# Altium project PCB_Project.PrjPcb
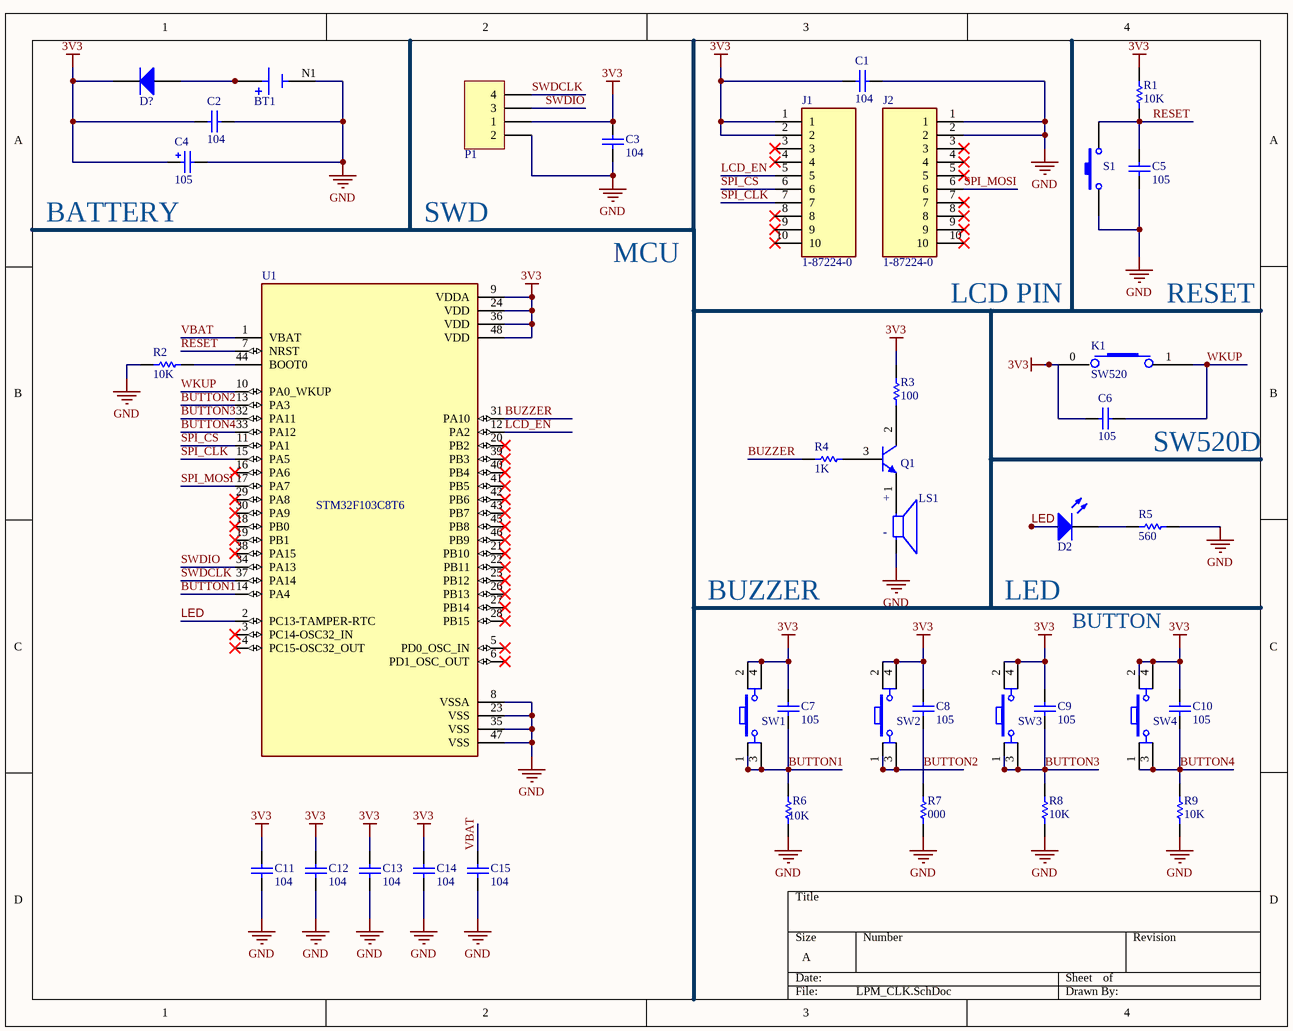
[diagram p0: LPM_CLK.SchDoc]
1 sheet, 39 parts. Net scope: global (net labels, ports and power ports of the same name join across sheets).
Board file: LPM_CLK.PcbDoc

## Sheet LPM_CLK.SchDoc
size A; SheetNumber: 1; SheetTotal: 1

### Parts
BT1  BAT-HLD-001  [BAT_BAT-HLD-001]  (value not drawn)
C1  value 104  [CAP-SM-0805]  (hidden comment: Cap Non-Pol SMD)
C2  value 104  [CAP-SM-0805]  (hidden comment: Cap Non-Pol SMD)
C3  value 104  [CAP-SM-0805]  (hidden comment: Cap Non-Pol SMD)
C4  value 105  [CP1/2]  (hidden comment: Cap Pol)
C5  value 105  [CAP-SM-0805]  (hidden comment: Cap Non-Pol SMD)
C6  value 105  [CAP-SM-0805]  (hidden comment: Cap Non-Pol SMD)
C7  value 105  [CAP-SM-0805]  (hidden comment: Cap Non-Pol SMD)
C8  value 105  [CAP-SM-0805]  (hidden comment: Cap Non-Pol SMD)
C9  value 105  [CAP-SM-0805]  (hidden comment: Cap Non-Pol SMD)
C10  value 105  [CAP-SM-0805]  (hidden comment: Cap Non-Pol SMD)
C11  value 104  [CAP-SM-0805]  (hidden comment: Cap Non-Pol SMD)
C12  value 104  [CAP-SM-0805]  (hidden comment: Cap Non-Pol SMD)
C13  value 104  [CAP-SM-0805]  (hidden comment: Cap Non-Pol SMD)
C14  value 104  [CAP-SM-0805]  (hidden comment: Cap Non-Pol SMD)
C15  value 104  [CAP-SM-0805]  (hidden comment: Cap Non-Pol SMD)
D2  LED SMD  [LED_0603_Blue]  (value not drawn)
D?  Diode  [D1A]  (value not drawn)
J1  1-87224-0  [TE_1-87224-0]
J2  1-87224-0  [TE_1-87224-0]
K1  SW520  [SW520D]
LS1  CMT-7525-80-SMT-TR  [XDCR_CMT-7525-80-SMT-TR]  (value not drawn)
P1  Header 4H  [JP4H]  (value not drawn)
Q1  C1815  [QTO-92]  (value not drawn)
R1  value 10K  [RES-SM-0603]  (hidden comment: RESISTOR SMD)
R2  value 10K  [RES-SM-0603]  (hidden comment: RESISTOR SMD)
R3  value 100  [RES-SM-0603]  (hidden comment: RESISTOR SMD)
R4  value 1K  [RES-SM-0603]  (hidden comment: RESISTOR SMD)
R5  value 560  [RES-SM-0603]  (hidden comment: RESISTOR SMD)
R6  value 10K  [RES-SM-0603]  (hidden comment: RESISTOR SMD)
R7  value 000  [RES-SM-0603]  (hidden comment: RESISTOR SMD)
R8  value 10K  [RES-SM-0603]  (hidden comment: RESISTOR SMD)
R9  value 10K  [RES-SM-0603]  (hidden comment: RESISTOR SMD)
S1  Tact SW - 2Pin  [SW-SMD]  (value not drawn)
SW1  SW  [Tact SW 4 pin]  (value not drawn)
SW2  SW  [Tact SW 4 pin]  (value not drawn)
SW3  SW  [Tact SW 4 pin]  (value not drawn)
SW4  SW  [Tact SW 4 pin]  (value not drawn)
U1  STM32F103C8T6  [QFP50P900X900X160-48N]

### Nets
3V3: C1.2 C2.1 C3.2 C4.1 C6.2 C7.2 C8.2 C9.2 C10.2 C11.2 C12.1 C13.2 C14.2 D?.2(K) J1.1 J1.2 K1.0(+) P1.1 R1.2 R3.2 SW1.2 SW1.4 SW2.2 SW2.4 SW3.2 SW3.4 SW4.2 SW4.4 U1.9(VDDA) U1.24(VDD) U1.36(VDD) U1.48(VDD)
GND: BT1.N1(NEG) C1.1 C2.2 C3.1 C4.2 C5.1 C11.1 C12.2 C13.1 C14.1 C15.1 J2.1 J2.2 LS1.N P1.2 R2.1 R5.2 R6.1 R7.1 R8.1 R9.1 S1.1 U1.8(VSSA) U1.23(VSS) U1.35(VSS) U1.47(VSS)
BUTTON1: C7.1 R6.2 SW1.1 SW1.3 U1.14(PA4)
BUTTON2: C8.1 R7.2 SW2.1 SW2.3 U1.13(PA3)
BUTTON3: C9.1 R8.2 SW3.1 SW3.3 U1.32(PA11)
BUTTON4: C10.1 R9.2 SW4.1 SW4.3 U1.33(PA12)
BUZZER: R4.1 U1.31(PA10)
LCD_EN: J1.5 U1.12(PA2)
LED: D2.1(A) U1.2(PC13-TAMPER-RTC)
RESET: C5.2 R1.1 S1.2 U1.7(NRST)
SPI_CLK: J1.7 U1.15(PA5)
SPI_CS: J1.6 U1.11(PA1)
SPI_MOSI: J2.6 U1.17(PA7)
SWDCLK: P1.4 U1.37(PA14)
SWDIO: P1.3 U1.34(PA13)
VBAT: C15.2 U1.1(VBAT)
WKUP: C6.1 K1.1(-) U1.10(PA0_WKUP)
NetBT1_P1: BT1.P1(POS) BT1.P2(POS) D?.1(A)
NetD2_2: D2.2(K) R5.1
NetLS1_P: LS1.P Q1.1(E)
NetQ1_2: Q1.2(C) R3.1
NetQ1_3: Q1.3(B) R4.2
NetR2_2: R2.2 U1.44(BOOT0)

Not connected (* = marked no-connect by the designer): J1 3* 4* 8* 9* 10*; J2 3* 4* 5* 7* 8* 9* 10*; U1 3(PC14-OSC32_IN)* 4(PC15-OSC32_OUT)* 5(PD0_OSC_IN)* 6(PD1_OSC_OUT)* 16(PA6)* 18(PB0)* 19(PB1)* 20(PB2)* 21(PB10)* 22(PB11)* 25(PB12)* 26(PB13)* 27(PB14)* 28(PB15)* 29(PA8)* 30(PA9)* 38(PA15)* 39(PB3)* 40(PB4)* 41(PB5)* 42(PB6)* 43(PB7)* 45(PB8)* 46(PB9)*

### Notes on the sheet
- (near C4) BATTERY
- SWD
- MCU
- (near J2) LCD PIN
- RESET
- SW520D
- BUZZER
- (near D2) LED
- BUTTON
- (in symbol CMT-7525-80-SMT-TR) +; -

### Library data of the parts
BT1 = BAT-HLD-001: Battery Retainer Coin, 20.0mm 1 Cell SMD (SMT) Tab; Value: *; MP: BAT-HLD-001; Package: None; Availability: Unavailable; Price: None
C1-C3 C5-C15 = Cap Non-Pol SMD: Capacitor
C4 = Cap Pol: Polarized Capacitor (Radial)
D2 = LED SMD: LED
D? = Diode: Default Diode
J1 J2 = 1-87224-0: Connector Unshrouded Header 10 Position 2.54mm Solder Straight Thru-Hole; Number_of_Positions: 10; MF: TE Connectivity; Centerline_Pitch: 2.54 mm[.1 in]; Price: None; Value: *; Product_Type: Connector; Package: None; SnapEDA_Link: https://www.snapeda.com/parts/1-87224-0/TE%20Connectivity%20AMP%20Connectors/view-part/506807/?ref=snap; Availability: Unavailable; MP: 1-87224-0; EU_RoHS_Compliance: Compliant
K1 = SW520D
LS1 = CMT-7525-80-SMT-TR: 7.5 mm, 3.6 Vo-p, 80 dB, Surface Mount (SMT), Magnetic Audio Transducer Buzzer; MF: CUI Devices; Value: *; Digi-Key_Part_Number: 102-CMT-7525-80-SMT-TR-ND; SnapEDA_Link: https://www.snapeda.com/parts/CMT-7525-80-SMT-TR/CUI+Devices/view-part/?ref=snap; Check_prices: https://www.snapeda.com/parts/CMT-7525-80-SMT-TR/CUI+Devices/view-part/?ref=eda; CUI_purchase_URL: https://www.cuidevices.com/product/audio/buzzers/audio-transducers/cmt-7525-80-smt-tr?utm_source=snapeda.com&utm_medium=referral&utm_campaign=snapedaBOM; Purchase-URL: https://pricing.snapeda.com/search/part/CMT-7525-80-SMT-TR/?ref=eda; Package: CUI Devices; MP: CMT-7525-80-SMT-TR
P1 = Header 4H: Header, 4-Pin, Right Angle; LatestRevisionDate: 17-Jul-2002; LatestRevisionNote: Re-released for DXP Platform.; Publisher: Altium Limited
Q1 = C1815: NPN Bipolar Transistor
R1-R9 = RESISTOR SMD: Resistor
S1 = Tact SW - 2Pin: Switch button 2 pin
SW1-SW4 = Tact SW - 4Pin: Switch button 4 pin; Value: Button chip 4 pin
U1 = STM32F103C8T6: ARMÂ® CortexÂ®-M3 STM32F1 Microcontroller IC 32-Bit 72MHz 64KB (64K x 8) FLASH 48-LQFP (7x7); MF: STMicroelectronics; Package: LQFP-48 STMicroelectronics; Price: None; Check_prices: https://www.snapeda.com/parts/STM32F103C8T6/STMicroelectronics/view-part/?ref=eda; Value: *; SnapEDA_Link: https://www.snapeda.com/parts/STM32F103C8T6/STMicroelectronics/view-part/?ref=snap; MP: STM32F103C8T6; Availability: In Stock; Purchase-URL: https://pricing.snapeda.com/search/part/STM32F103C8T6/?ref=eda